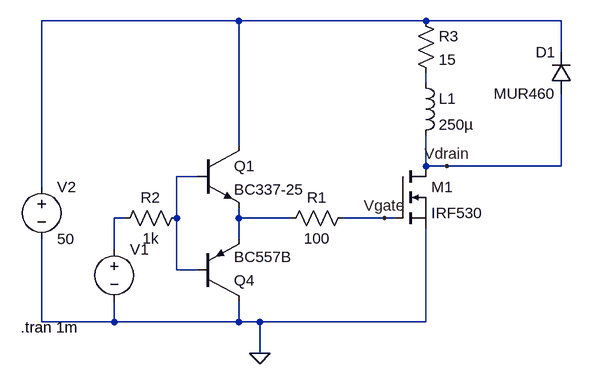
[diagram p0: schematic punto1.asc]
punto1.asc, the LTspice schematic file:
Version 4
SHEET 1 880 680
WIRE 288 -144 -16 -144
WIRE 576 -144 288 -144
WIRE 784 -144 576 -144
WIRE 784 -96 784 -144
WIRE 576 -48 576 -64
WIRE 288 48 288 -144
WIRE 576 80 576 32
WIRE 608 80 576 80
WIRE 784 80 784 -32
WIRE 784 80 608 80
WIRE 224 96 192 96
WIRE -16 112 -16 -144
WIRE 112 160 96 160
WIRE 192 160 192 96
WIRE 288 160 288 144
WIRE 368 160 288 160
WIRE 512 160 448 160
WIRE 528 160 512 160
WIRE 288 192 288 160
WIRE 96 208 96 160
WIRE 192 240 192 160
WIRE 224 240 192 240
WIRE -16 320 -16 192
WIRE 96 320 96 288
WIRE 96 320 -16 320
WIRE 288 320 288 288
WIRE 288 320 96 320
WIRE 320 320 288 320
WIRE 576 320 576 176
WIRE 576 320 320 320
WIRE 320 368 320 320
FLAG 320 368 0
FLAG 608 80 Vdrain
FLAG 512 160 Vgate
SYMBOL voltage -16 96 R0
WINDOW 123 0 0 Left 0
WINDOW 39 0 0 Left 0
SYMATTR InstName V2
SYMATTR Value 50
SYMBOL npn 224 48 R0
SYMATTR InstName Q1
SYMATTR Value BC337-25
SYMBOL pnp 224 288 M180
SYMATTR InstName Q4
SYMATTR Value BC557B
SYMBOL nmos 528 80 R0
SYMATTR InstName M1
SYMATTR Value IRF530
SYMBOL res 464 144 R90
WINDOW 0 0 56 VBottom 2
WINDOW 3 32 56 VTop 2
SYMATTR InstName R1
SYMATTR Value 100
SYMBOL res 208 144 R90
WINDOW 0 0 56 VBottom 2
WINDOW 3 32 56 VTop 2
SYMATTR InstName R2
SYMATTR Value 1k
SYMBOL res 560 -160 R0
SYMATTR InstName R3
SYMATTR Value 15
SYMBOL diode 800 -32 R180
WINDOW 0 24 64 Left 2
WINDOW 3 24 0 Left 2
SYMATTR InstName D1
SYMATTR Value MUR460
SYMBOL ind 560 -64 R0
SYMATTR InstName L1
SYMATTR Value 250µ
SYMBOL voltage 96 192 R0
WINDOW 123 0 0 Left 0
WINDOW 39 0 0 Left 0
WINDOW 3 24 44 Invisible 2
SYMATTR InstName V1
SYMATTR Value PULSE(0 15 1n 1n 1n 20u 40u)
TEXT -48 328 Left 2 !.tran 1m

The netlist it stands for:
* punto1.asc
V2 N001 0 50
Q1 N001 N003 N005 0 BC337-25
Q4 0 N003 N005 0 BC557B
M1 Vdrain Vgate 0 0 IRF530
R1 Vgate N005 100
R2 N003 N004 1k
R3 N001 N002 15
D1 Vdrain N001 MUR460
L1 N002 Vdrain 250µ
V1 N004 0 PULSE(0 15 1n 1n 1n 20u 40u)
.model D D
.lib standard.dio
.model NPN NPN
.model PNP PNP
.lib standard.bjt
.model NMOS NMOS
.model PMOS PMOS
.lib standard.mos
.tran 1m
.backanno
.end